# Altium schematic sheet Relay fused CKT.SchDoc
size A
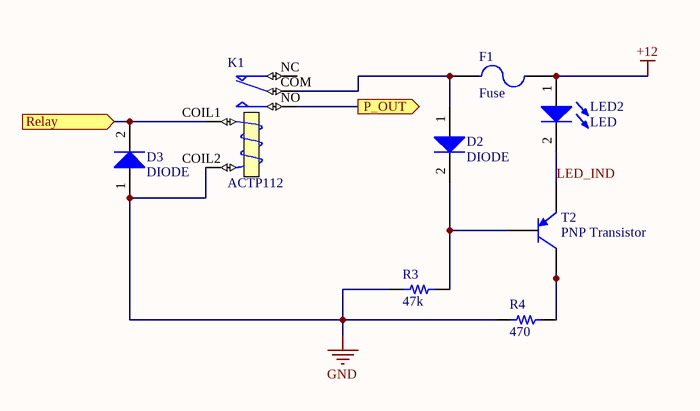
[diagram p0: Relay fused CKT.SchDoc]

## Parts
D2  DIODE  [SOD123F]
D3  DIODE  [SOD123F]
F1  Fuse  [3568-MiniFuseHolder]
K1  ACTP112  [ACTP112]
LED2  LED  [0805_LED]
R3  value 47k  [RES 0805/2012]  (hidden comment: Resistor 47k 0805 1/10W 1%)
R4  value 470  [RES 0805/2012]  (hidden comment: Resistor 470 0805 1/10W 1%)
T2  PNP Transistor  [SOT23-3]

## Ports
P_OUT (out), Relay (in)

## Nets
+12: F1.2 LED2.1(A)
GND: D3.1(A) K1.COIL2(T2) R3.2 R4.2
LED_IND: LED2.2(K) T2.2(E)
P_OUT: K1.NO ; port P_OUT
Relay: D3.2(K) K1.COIL1(T1) ; port Relay
NetD2_1: D2.1(A) F1.1 K1.COM
NetD2_2: D2.2(K) R3.1 T2.1(B)
NetR4_1: R4.1 T2.3(C)

Not connected (* = marked no-connect by the designer): K1 NC

## Library data of the parts
D2 D3 = 2: Diode Super Barrier 40V 1A Surface Mount SOD-123F; Manufacturer_id: 1; MfrPartNo: 1N5819HW1-7-F; idDiode: 2; Name: 1N5819; Drawer_id: 1; Value: 1A; Type: Super Barrier; Num_Circuits: 1; Ic: 1A; Power: 40V; Package: SOD-123; Link: https://www.digikey.com/product-detail/en/diodes-incorporated/1N5819HW1-7-F/1N5819HW1-7-FDITR-ND/5768523; ComponentLink1Description: Datasheet; ComponentLink1URL: https://www.diodes.com/assets/Datasheets/1N5819HW1.pdf; Supplier1: Digi-Key; Supplier1PartNo: 1N5819HW1-7-FDITR-ND
F1 = 3: Manufacturer_id: 1; idFuse: 3; Name: 3568 Mini Fuse Holder; Drawer_id: 1
K1 = 3: Manufacturer_id: 1; idRelay: 3; Coil_Voltage: 12V; Published: 8-Jun-2000; LatestRevisionDate: 17-Jul-2002; LatestRevisionNote: Re-released for DXP Platform.; PackageReference: MODULE5B; Publisher: Altium Limited; Drawer_id: 1; Name: ACTP112
LED2 = 1: idLED: 1; Name: LED_0805_RED; Value: Red; Vf: 0.7V; Manufacturer_id: 1; Drawer_id: 1; Package: 0805
R3 = 545: Manufacturer_id: 1; idResistor: 545; Name: Res_47k_0805_1/10W_1%; Created_By: Nick Mah; Supplier 1: Digi-Key; Drawer_id: 1; Tolerance: 1%; Power: 1/10W; Package: 0805; ComponentLink1Description: Datasheet; Created_Date: 2018-10-20
R4 = 497: Manufacturer_id: 1; idResistor: 497; Name: Res_470_0805_1/10W_1%; Created_By: Nick Mah; Supplier 1: Digi-Key; Drawer_id: 1; Tolerance: 1%; Power: 1/10W; Package: 0805; ComponentLink1Description: Datasheet; Created_Date: 2018-10-20
T2 = 3: Manufacturer_id: 1; idBJT: 3; Name: MMBT4403WT1G; Ic: 600mA; Vce(Max): -40V; Created_By: Angel; Drawer_id: 1; Type: PNP; Num_Circuits: 1; Package: SOT23-3; MfrPartNo: MMBT4403WT1G; Link: https://www.digikey.com/product-detail/en/on-semiconductor/MMBT4403WT1G/MMBT4403WT1GOSCT-ND/3487572